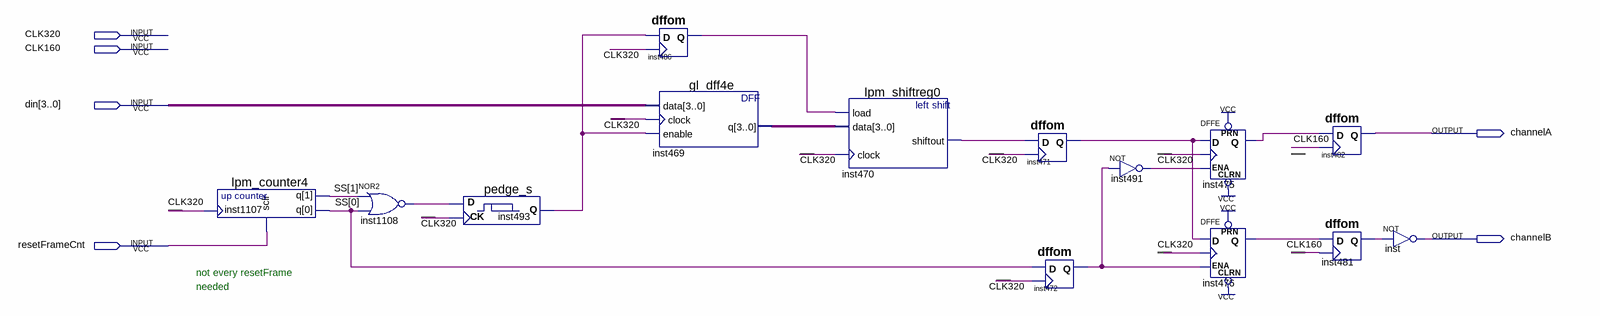
[diagram p0: schematic sheet]
// Quartus schematic demux_tbmAB.bdf as structural Verilog: 14 symbols, 6 pins
module demux_tbmAB (
  input  CLK320,
  input  CLK160,
  input  [3:0] din,
  input  resetFrameCnt,
  output channelA,
  output channelB
);

  wire inst470_shiftout, inst471_q, inst472_q, inst475_q, inst476_q, inst481_q, inst486_q, inst491_out,
       inst493_q, inst1108_out;
  wire [1:0] SS;
  wire [3:0] inst469_q;

  lpm_counter4 inst1107 (.sclr(resetFrameCnt), .clock(CLK320), .q(SS));
  nor inst1108 (inst1108_out, SS[1], SS[0]);
  pedge_s inst493 (.D(inst1108_out), .CK(CLK320), .Q(inst493_q));
  dffom inst486 (.D(inst493_q), .CK(CLK320), .Q(inst486_q));
  gl_dff4e inst469 (.data(din), .clock(CLK320), .enable(inst493_q), .q(inst469_q));
  lpm_shiftreg0 inst470 (.load(inst486_q), .data(inst469_q), .clock(CLK320), .shiftout(inst470_shiftout));
  dffom inst471 (.D(inst470_shiftout), .CK(CLK320), .Q(inst471_q));
  dffom inst472 (.D(SS[0]), .CK(CLK320), .Q(inst472_q));
  not inst491 (inst491_out, inst472_q);
  DFFE inst475 (.PRN(1'b1), .CLRN(1'b1), .D(inst471_q), .CLK(CLK320), .ENA(inst491_out), .Q(inst475_q));
  DFFE inst476 (.PRN(1'b1), .CLRN(1'b1), .D(inst471_q), .CLK(CLK320), .ENA(inst472_q), .Q(inst476_q));
  dffom inst482 (.D(inst475_q), .CK(CLK160), .Q(channelA));
  dffom inst481 (.D(inst476_q), .CK(CLK160), .Q(inst481_q));
  not inst (channelB, inst481_q);

  // Notes on the sheet:
  //   not every resetFrame
  //   needed
endmodule
